# EAGLE design ATXmega64A4U 1 (EAGLE 7.4.0)
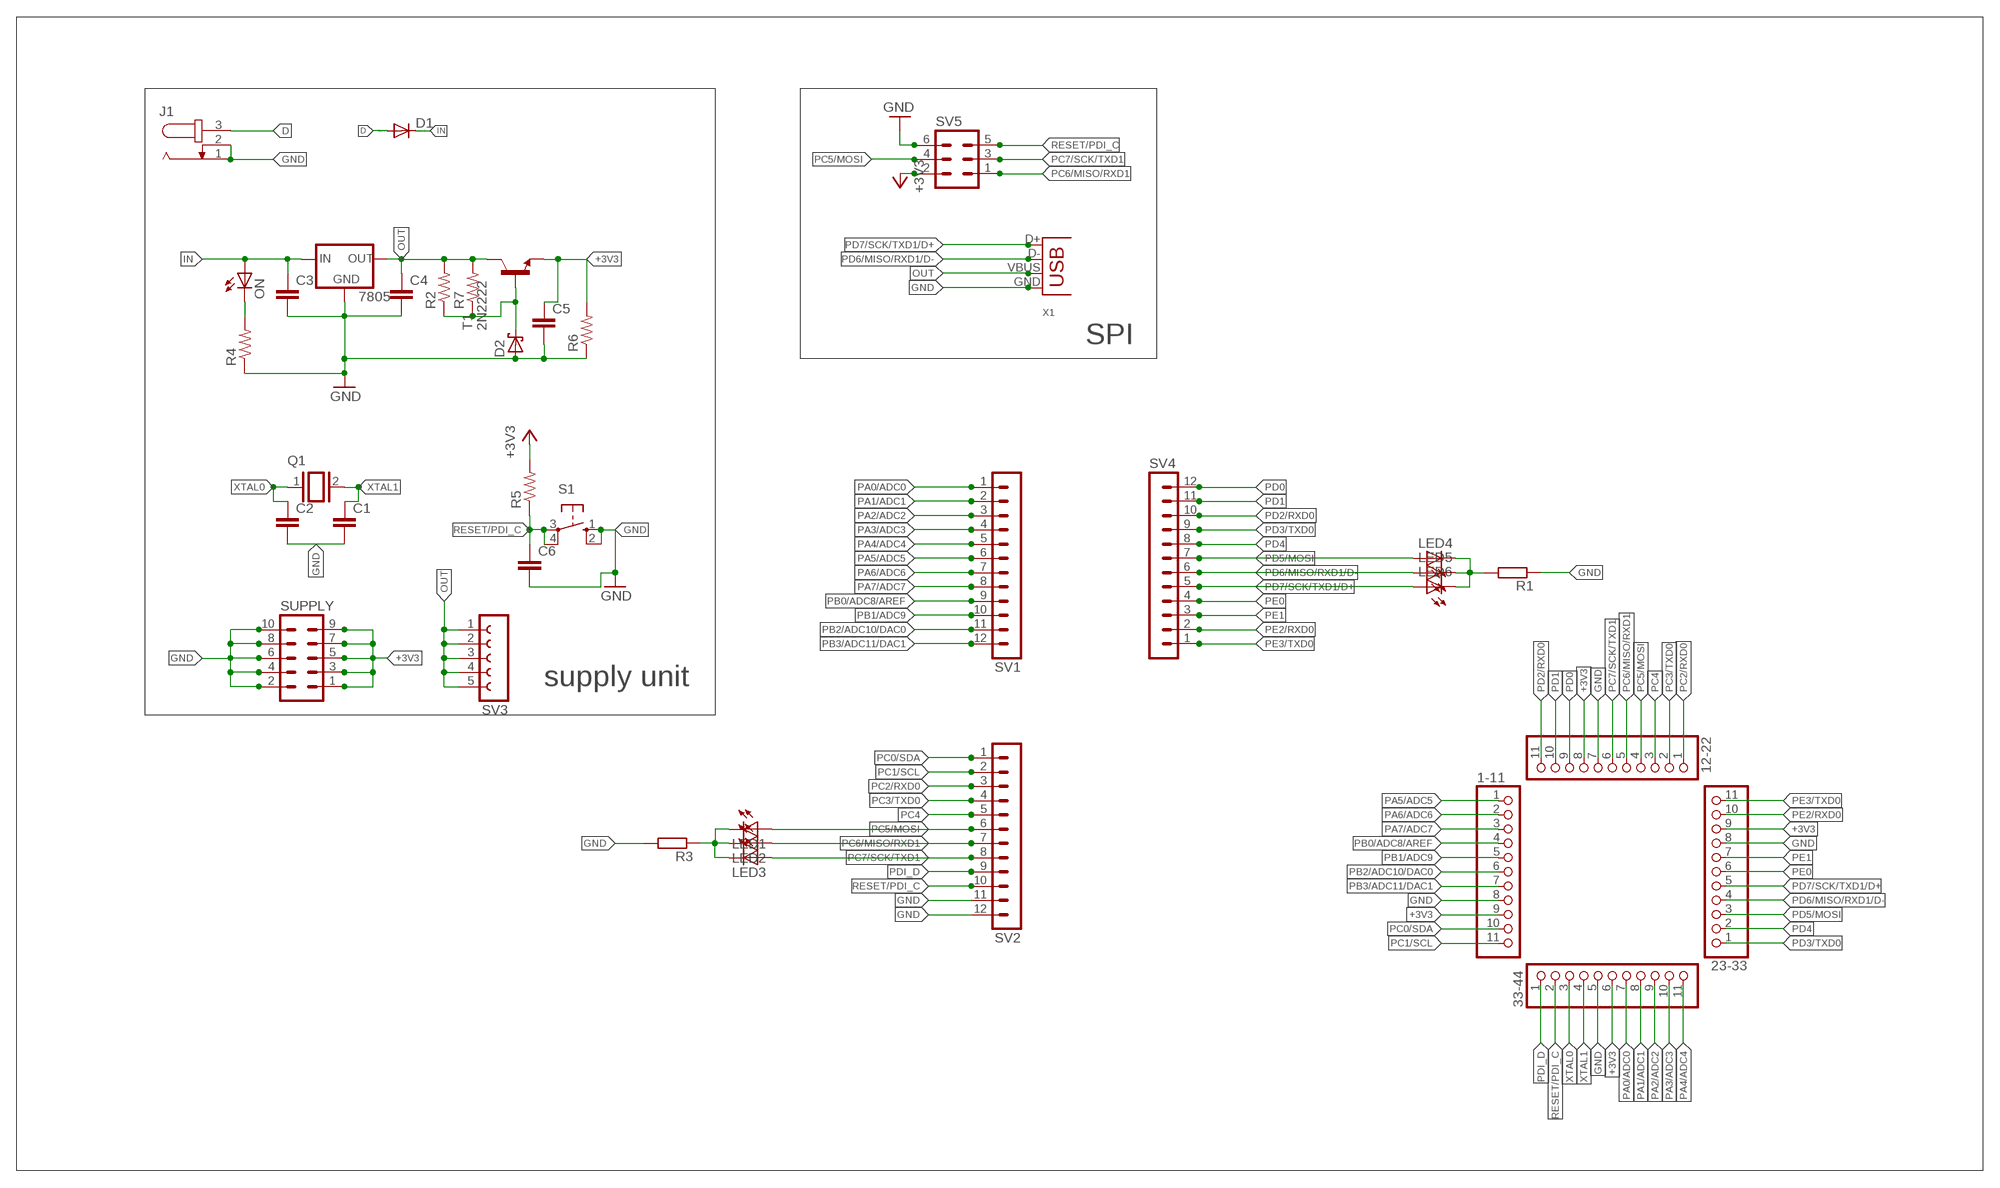
[diagram p0: schematic, sheet 1]

## Parts
1-11  PINHD-1X11/LONG  [1X11]
12-22  PINHD-1X11/LONG  [1X11]
23-33  PINHD-1X11/LONG  [1X11]
33-44  PINHD-1X11/LONG  [1X11]
7805  78XXL  [78XXL]
C1  C-EU025-025X050  [C025-025X050]
C2  C-EU025-025X050  [C025-025X050]
C3  C-EU025-025X050  [C025-025X050]
C4  C-EU025-025X050  [C025-025X050]
C5  C-EU025-025X050  [C025-025X050]
C6  C-EU025-025X050  [C025-025X050]
D1  1N4004  [DO41-10]
D2  SCHOTTKY-DIODEDO35-7  [DO35-7]
J1  JACK-PLUG0  [SPC4077]
LED1  LEDCHIPLED_0805  [CHIPLED_0805]
LED2  LEDCHIPLED_0805  [CHIPLED_0805]
LED3  LEDCHIPLED_0805  [CHIPLED_0805]
LED4  LEDCHIPLED_0805  [CHIPLED_0805]
LED5  LEDCHIPLED_0805  [CHIPLED_0805]
LED6  LEDCHIPLED_0805  [CHIPLED_0805]
ON  LEDCHIP-LED0805  [CHIP-LED0805]
Q1  XTAL/S  [QS]
R1  R-EU_0207/7  [0207/7]
R2  R-US_0207/7  [0207/7]
R3  R-EU_0207/7  [0207/7]
R4  R-US_0207/7  [0207/7]
R5  R-US_0207/7  [0207/7]
R6  R-US_0207/7  [0207/7]
R7  R-US_0207/7  [0207/7]
S1  10-XX  [B3F-10XX]
SUPPLY  MA05-2  [MA05-2]
SV1  MA12-1  [MA12-1]
SV2  MA12-1  [MA12-1]
SV3  FE05-1  [FE05-1]
SV4  MA12-1  [MA12-1]
SV5  MA03-2  [MA03-2]
T1  2N2222  [TO18]
X1  USB-B-H  [USB-B-H]

## Nets
+3V3: 1-11.9 12-22.8 23-33.9 33-44.6 C5.1 R5.2 R6.2 SUPPLY.1 SUPPLY.3 SUPPLY.5 SUPPLY.7 SUPPLY.9 SV5.2 T1.1(E)
D: D1.A J1.3
GND: 1-11.8 12-22.7 23-33.8 33-44.5 7805.GND C1.2 C2.2 C3.2 C4.2 C5.2 C6.2 D2.A J1.1 J1.2 R1.1 R3.2 R4.1 R6.1 S1.1(S) S1.2(S1) SUPPLY.2 SUPPLY.4 SUPPLY.6 SUPPLY.8 SUPPLY.10 SV2.11 SV2.12 SV5.6 X1.GND
IN: 7805.IN C3.1 D1.C ON.A
N$1: ON.C R4.2
N$2: LED1.C LED2.C LED3.C R3.1
N$4: D2.C R2.1 R7.1 T1.2(B)
N$5: LED4.C LED5.C LED6.C R1.2
OUT: 7805.OUT C4.1 R2.2 R7.2 SV3.1 SV3.2 SV3.3 SV3.4 SV3.5 T1.3(C) X1.VBUS
PA0/ADC0: 33-44.7 SV1.1
PA1/ADC1: 33-44.8 SV1.2
PA2/ADC2: 33-44.9 SV1.3
PA3/ADC3: 33-44.10 SV1.4
PA4/ADC4: 33-44.11 SV1.5
PA5/ADC5: 1-11.1 SV1.6
PA6/ADC6: 1-11.2 SV1.7
PA7/ADC7: 1-11.3 SV1.8
PB0/ADC8/AREF: 1-11.4 SV1.9
PB1/ADC9: 1-11.5 SV1.10
PB2/ADC10/DAC0: 1-11.6 SV1.11
PB3/ADC11/DAC1: 1-11.7 SV1.12
PC0/SDA: 1-11.10 SV2.1
PC1/SCL: 1-11.11 SV2.2
PC2/RXD0: 12-22.1 SV2.3
PC3/TXD0: 12-22.2 SV2.4
PC4: 12-22.3 SV2.5
PC5/MOSI: 12-22.4 LED1.A SV2.6 SV5.4
PC6/MISO/RXD1: 12-22.5 LED2.A SV2.7 SV5.1
PC7/SCK/TXD1: 12-22.6 LED3.A SV2.8 SV5.3
PD0: 12-22.9 SV4.12
PD1: 12-22.10 SV4.11
PD2/RXD0: 12-22.11 SV4.10
PD3/TXD0: 23-33.1 SV4.9
PD4: 23-33.2 SV4.8
PD5/MOSI: 23-33.3 LED4.A SV4.7
PD6/MISO/RXD1/D-: 23-33.4 LED5.A SV4.6 X1.D-
PD7/SCK/TXD1/D+: 23-33.5 LED6.A SV4.5 X1.D+
PDI_D: 33-44.1 SV2.9
PE0: 23-33.6 SV4.4
PE1: 23-33.7 SV4.3
PE2/RXD0: 23-33.10 SV4.2
PE3/TXD0: 23-33.11 SV4.1
RESET/PDI_C: 33-44.2 C6.1 R5.1 S1.3(P) S1.4(P1) SV2.10 SV5.5
XTAL0: 33-44.3 C2.1 Q1.1
XTAL1: 33-44.4 C1.1 Q1.2

## Notes on the sheet
- SPI
- supply unit

## Library data of the parts
1-11 12-22 23-33 33-44 = pinhead_v2:PINHD-1X11: PIN HEADER
7805 = v-reg:78XXL: VOLTAGE REGULATOR
C1-C6 = resistor:C-EU: CAPACITOR, European symbol
D1 = diode:1N4004: DIODE general purpose rectifier, 1 A
D2 = diode:SCHOTTKY-DIODE: Schottky Diode
J1 = con-jack:JACK-PLUG: DC POWER JACK Power Jack, DC, Right Angle, Through Hole, Rated 5A at 16VDC, PC Terminals Distributor: Farnell (www.Farnell.de) Drawing: 84N1161.pdf / 84N1162.pdf Manufacturer: SPC Technology (www.spctechnology.com) Type: SPC4077 / SPC 4078; OC_FARNELL: unknown; OC_NEWARK: unknown
LED1-LED6 ON = led:LED: LED OSRAM: - CHIPLED LG R971, LG N971, LY N971, LG Q971, LY Q971, LO R971, LY R971 LH N974, LH R974 LS Q976, LO Q976, LY Q976 LO Q996 - Hyper CHIPLED LW Q18S LB Q993, LB Q99A, LB R99A - SideLED LS A670, LO A670, LY A670, LG A670, LP A670 LB A673, LV A673, LT A673, LW A673 LH A674 LY A675 LS A676, LA A676, LO A676, LY A676, LW A676 LS A679, LY A679, LG A679 - Hyper Micro SIDELED® LS Y876, LA Y876, LO Y876, LY Y876 LT Y87S - SmartLED LW L88C, LW L88S LB L89C, LB L89S, LG L890 LS L89K, LO L89K, LY L89K LS L896, LA L896, LO L896, LY L896 - TOPLED LS T670, LO T670, LY T670, LG T670, LP T670 LSG T670, LSP T670, LSY T670, LOP T670, LYG T670 LG T671, LOG T671, LSG T671 LB T673, LV T673, LT T673, LW T673 LH T674 LS T676, LA T676, LO T676, LY T676, LB T676, LH T676, LSB T676, LW T676 LB T67C, LV T67C, LT T67C, LS T67K, LO T67K, LY T67K, LW E67C LS E67B, LA E67B, LO E67B, LY E67B, LB E67C, LV E67C, LT E67C LW T67C LS T679, LY T679, LG T679 LS T770, LO T770, LY T770, LG T770, LP T770 LB T773, LV T773, LT T773, LW T773 LH T774 LS E675, LA E675, LY E675, LS T675 LS T776, LA T776, LO T776, LY T776, LB T776 LHGB T686 LT T68C, LB T68C - Hyper Mini TOPLED® LB M676 - Mini TOPLED Santana® LG M470 LS M47K, LO M47K, LY M47K Source: http://www.osram.convergy.de LUXEON: - LUMILED® LXK2-PW12-R00, LXK2-PW12-S00, LXK2-PW14-U00, LXK2-PW14-V00 LXK2-PM12-R00, LXK2-PM12-S00, LXK2-PM14-U00 LXK2-PE12-Q00, LXK2-PE12-R00, LXK2-PE12-S00, LXK2-PE14-T00, LXK2-PE14-U00 LXK2-PB12-K00, LXK2-PB12-L00, LXK2-PB12-M00, LXK2-PB14-N00, LXK2-PB14-P00, LXK2-PB14-Q00 LXK2-PR12-L00, LXK2-PR12-M00, LXK2-PR14-Q00, LXK2-PR14-R00 LXK2-PD12-Q00, LXK2-PD12-R00, LXK2-PD12-S00 LXK2-PH12-R00, LXK2-PH12-S00 LXK2-PL12-P00, LXK2-PL12-Q00, LXK2-PL12-R00 Source: www.luxeon.com KINGBRIGHT: KA-3528ASYC Source: www.kingbright.com
Q1 = special:XTAL/S: CRYSTAL
R1 R3 = resistor:R-EU_: RESISTOR, European symbol
R2 R4-R7 = rcl:R-US_: RESISTOR, American symbol
S1 = switch-omron:10-XX: OMRON SWITCH; MPN: B3F-1000; OC_FARNELL: 176432; OC_NEWARK: 36M3542
SUPPLY = con-lstb:MA05-2: PIN HEADER; OC_FARNELL: unknown; OC_NEWARK: unknown
SV1 SV2 SV4 = con-lstb:MA12-1: PIN HEADER; OC_FARNELL: unknown; OC_NEWARK: unknown
SV3 = con-lsta:FE05-1: FEMALE HEADER; OC_FARNELL: unknown; OC_NEWARK: unknown
SV5 = con-lstb:MA03-2: PIN HEADER; OC_FARNELL: unknown; OC_NEWARK: unknown
T1 = transistor-neu-to92:2N2222: NPN TRANSISTOR
X1 = con-usb-3:USB: USB Connectors

## Board
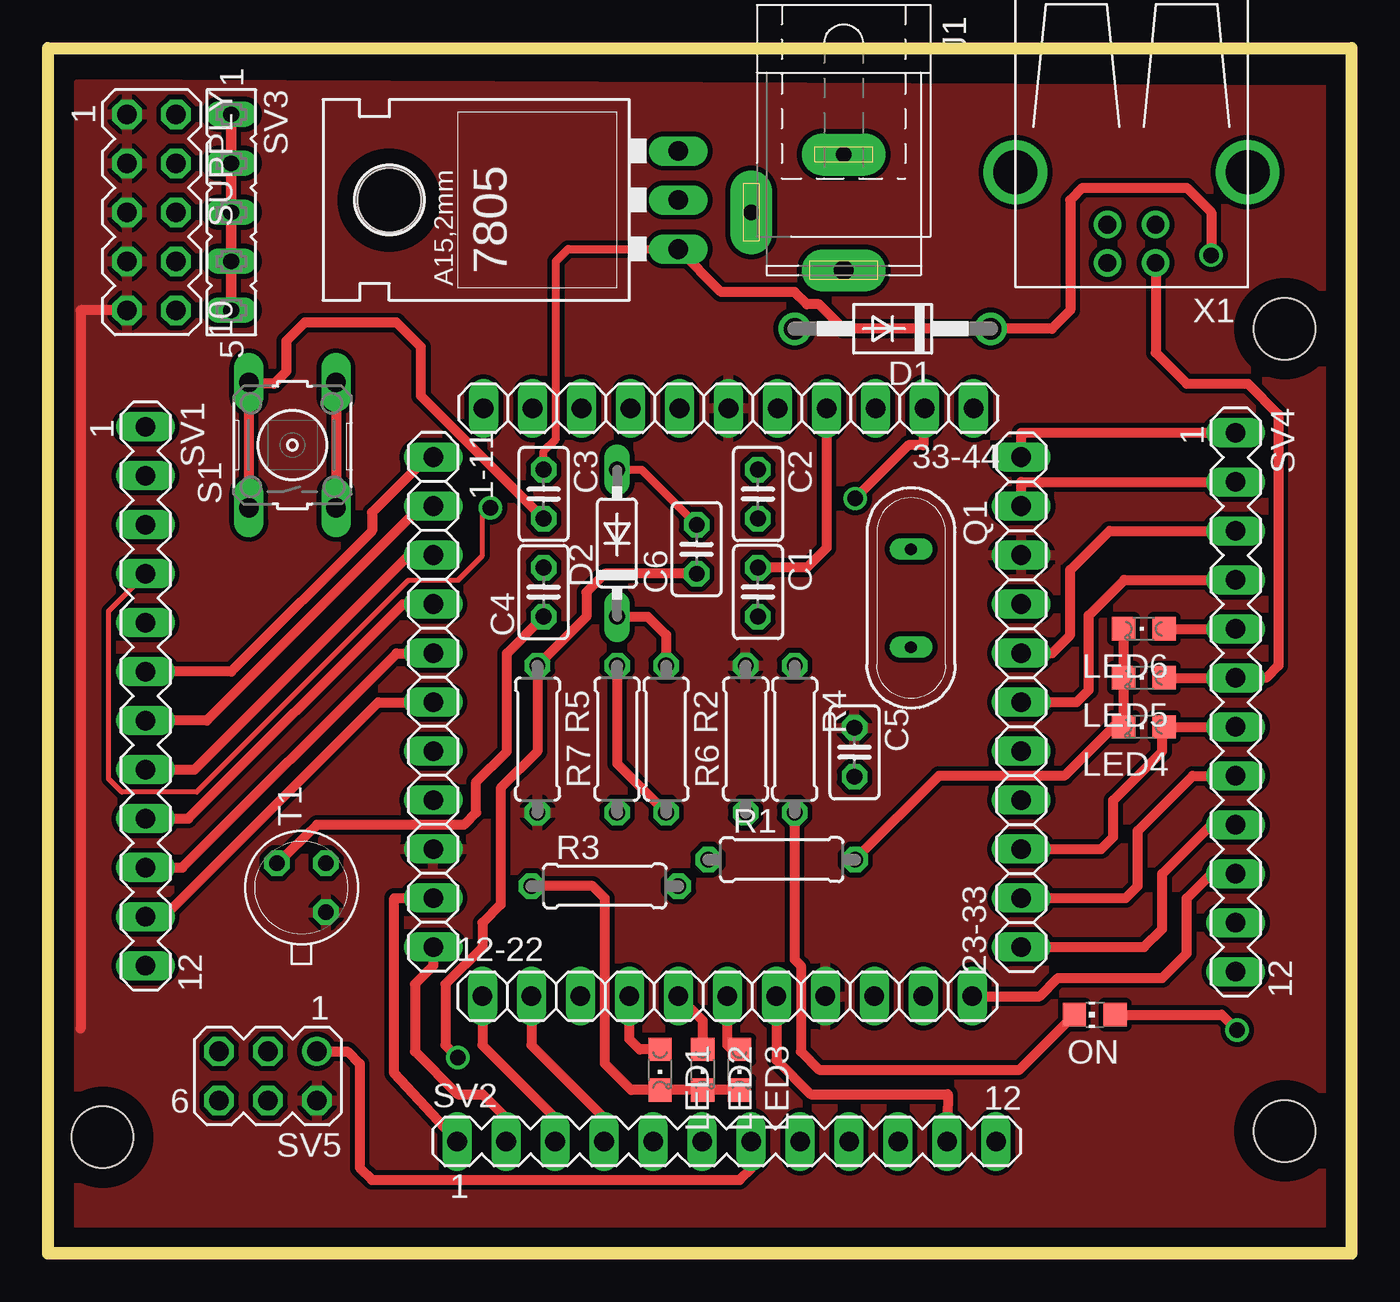
[diagram p1: board, top side]
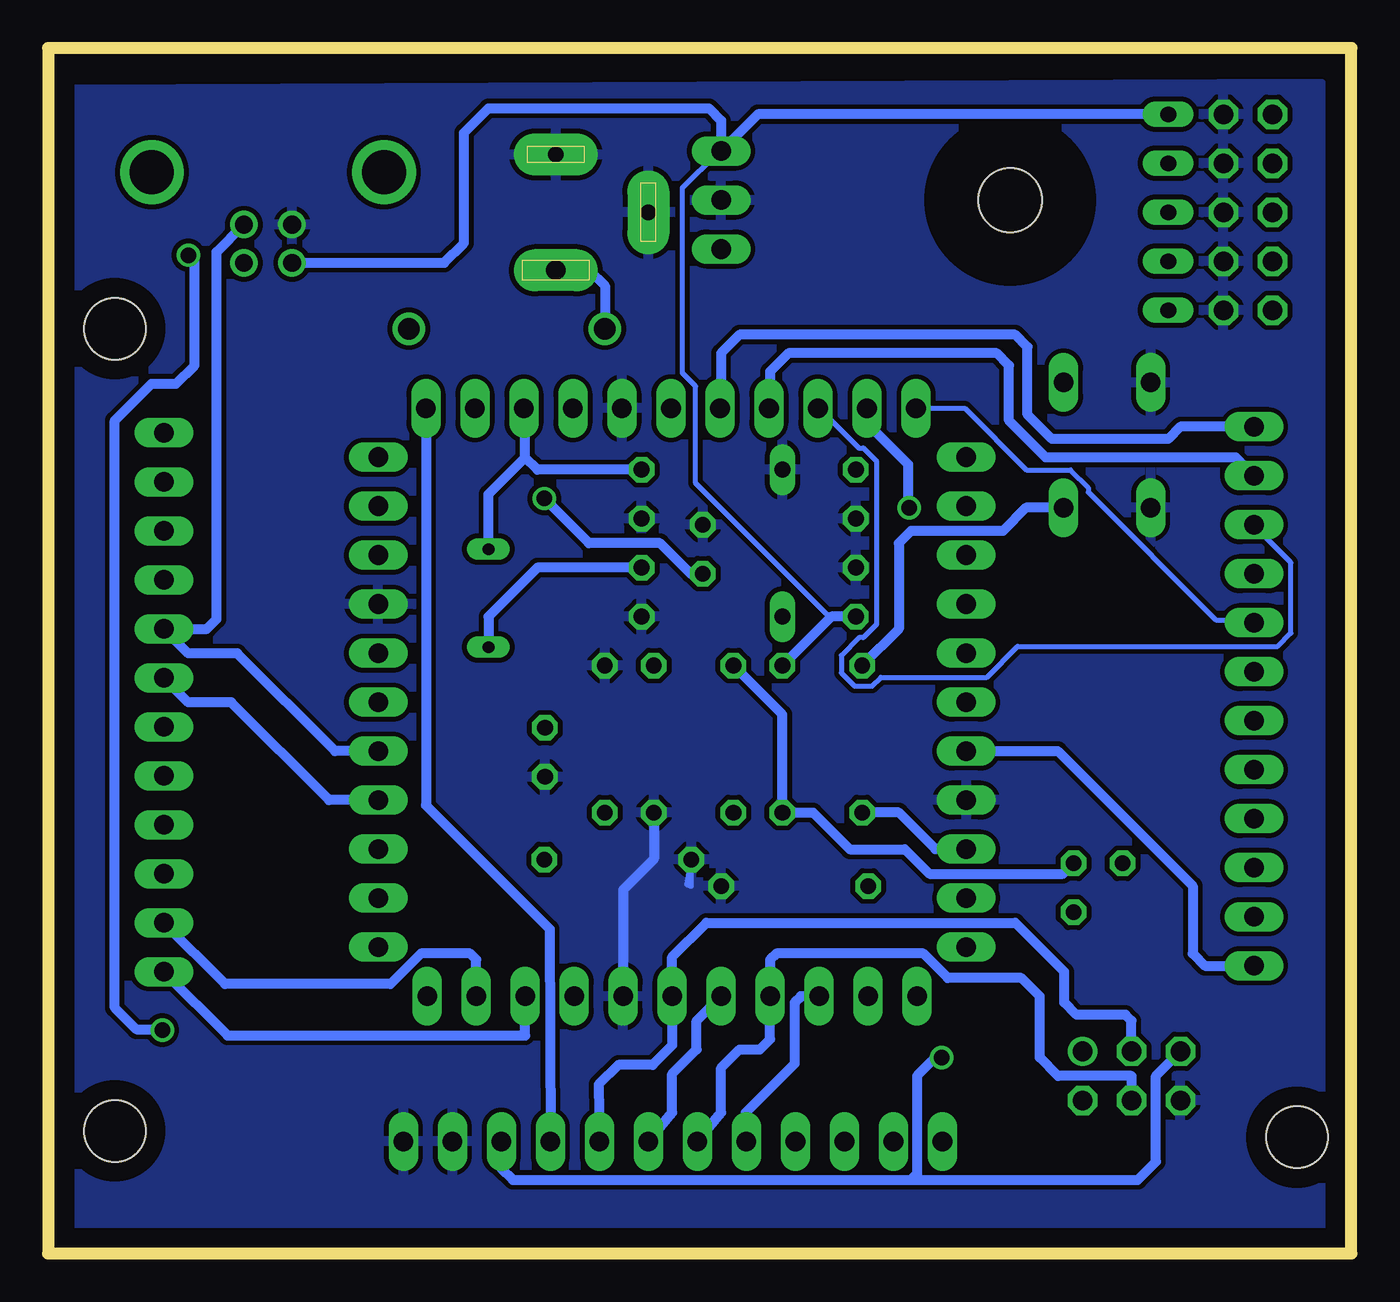
[diagram p2: board, bottom side, seen from below]

Size 67.55 x 62.48 mm. Coordinates in mm from the lower left corner, seen from the top.
Outline: 0,62.48 67.55,62.48 67.55,0 0,0 0,62.48
Copper layers (1*16): Top 0.035mm / dielectric 1.5mm / Bottom 0.035mm
Design rules "default": minimum track width 10mil, minimum drill 24mil, track to track 8mil, track to pad 8mil, pad to pad 8mil, via to via 8mil, smd to smd 8mil, copper to edge 40mil, drill to drill 8mil, minimum pad ring 10mil, minimum via ring 8mil, stop-mask expansion 4mil, vias tented up to drill 0mil, thermal gap 10mil
Holes 3.2 mm at 64.1,6.35 64.1,47.94 2.82,6.03

### Footprints (pad centres in the part's own frame; a part is rotated, then mirrored left to right if it is on the bottom)
1X11 = drill 1.016 long: 1 -12.7,0; 2 -10.16,0; 3 -7.62,0; 4 -5.08,0; 5 -2.54,0; 6 0,0; 7 2.54,0; 8 5.08,0; 9 7.62,0; 10 10.16,0; 11 12.7,0
78XXL = drill 1.016 long: GND 0,-3.81; IN -2.54,-3.81; OUT 2.54,-3.81 | hole 3.302: 0,11.176
C025-025X050 = drill 0.813 octagon: 1 -1.27,0; 2 1.27,0
DO41-10 = drill 1.118: A 5.08,0; C -5.08,0
DO35-7 = drill 0.813 long: A 3.81,0; C -3.81,0
SPC4077 = drill 0.8 pad 2.184 long: 1 -3,0; 2 0,-4.8 | drill 1 pad 2.184 long: 3 3,0
CHIPLED_0805 = smd 1.2 x 1.2: A 0,-1.05; C 0,1.05
CHIP-LED0805 = smd 1.2 x 1.2: A 0,-1.05; C 0,1.05
QS = drill 0.61 long: 1 -2.54,0; 2 2.54,0
0207/7 = drill 0.813 octagon: 1 -3.81,0; 2 3.81,0
B3F-10XX = drill 1.016 long: 1 -3.251,2.261; 2 3.251,2.261; 3 -3.251,-2.261; 4 3.251,-2.261
MA05-2 = drill 1.016 octagon: 1 -5.08,-1.27; 2 -5.08,1.27; 3 -2.54,-1.27; 4 -2.54,1.27; 5 0,-1.27; 6 0,1.27; 7 2.54,-1.27; 8 2.54,1.27; 9 5.08,-1.27; 10 5.08,1.27
MA12-1 = drill 1.016 long: 1 -13.97,0; 2 -11.43,0; 3 -8.89,0; 4 -6.35,0; 5 -3.81,0; 6 -1.27,0; 7 1.27,0; 8 3.81,0; 9 6.35,0; 10 8.89,0; 11 11.43,0; 12 13.97,0
FE05-1 = drill 0.813 long: 1 -5.08,0; 2 -2.54,0; 3 0,0; 4 2.54,0; 5 5.08,0
MA03-2 = drill 1.016: 1 -2.54,-1.27 | drill 1.016 octagon: 2 -2.54,1.27; 3 0,-1.27; 4 0,1.27; 5 2.54,-1.27; 6 2.54,1.27
TO18 = drill 0.813 octagon: 1 -1.27,-1.27; 2 1.27,-1.27; 3 1.27,1.27
USB-B-H = drill 0.914: D+ 0,1.25; D- 1.981,1.25; GND 0,-1.25; VBUS 1.981,-1.25 | drill 2.286: P$1 -2.718,-6.02; P$2 -2.718,6.02

### Placement (x,y rotation side)
1-11  19.96,28.59 270 top
12-22  35.2,13.34 0 top
23-33  50.44,28.59 90 top
33-44  35.27,43.81 180 top
7805  28.85,54.61 90 top
C1  36.79,34.29 270 top
C2  36.79,39.37 270 top
C3  25.68,39.37 270 top
C4  25.68,34.29 90 top
C5  41.8,25.98 270 top
C6  33.62,36.51 90 top
D1  43.78,47.94 180 top
D2  29.49,36.83 90 top
J1  41.24,53.98 270 top
LED1  31.71,9.52 180 top
LED2  33.93,9.52 180 top
LED3  35.84,9.52 180 top
LED4  56.79,27.3 90 top
LED5  56.79,29.84 90 top
LED6  56.79,32.38 90 top
ON  54.25,12.38 90 top
Q1  44.73,33.97 270 top
R1  38.02,20.42 0 top
R2  32.03,26.67 270 top
R3  28.85,19.05 0 top
R4  38.7,26.67 270 top
R5  25.36,26.67 270 top
R6  36.16,26.67 90 top
R7  29.49,26.67 90 top
S1  12.66,41.91 90 top
SUPPLY  5.36,53.98 270 top
SV1  5.04,28.89 270 top
SV2  35.17,5.8 0 top
SV3  9.49,53.98 270 top
SV4  61.56,28.57 270 top
SV5  11.39,9.21 180 top
T1  13.13,18.96 90 top
X1  56.16,53.34 270 top

### Tracks (layer width: path | path; a pad name or v marks a point on that pad's centre or on a via)
+3V3
  Top 0.508: SUPPLY.9 1.68,48.89 1.68,11.66
  Bottom 0.508: 1-11.9 21.56,20.97 23.46,22.86 R5.2
  pour Top (isolate 0.254): 1.55,60.64 66.32,60.32 66.28,1.17 1.51,1.49
D
  Bottom 0.508: J1.3 39.51,50.98 38.7,50.16 D1.A
GND
  Top 0.406: D2.A 30.76,40.64 C6.2
  Top 0.508: 12-22.7 37.74,10.03 39.52,8.25 46.63,8.25 SV2.11 | S1.1 S1.2 10.48,45.09 11.71,45.09 12.34,45.72 12.34,47.31 13.3,48.26 18.06,48.26 19.33,46.99 19.33,44.45 C3.2
  Bottom 0.254: 34.21,19.05 R1.1 34.44,19.13 34.25,19.05
  Bottom 0.508: R6.1 36.16,20.45 37.74,18.86 12-22.7
  pour Bottom (isolate 0.254): 1.55,60.64 66.32,60.32 66.28,1.17 1.51,1.49
IN  (via drill 0.8)
  Top 0.406: C3.1 25.68,41.59 26.31,42.23 26.31,51.43 26.95,52.07 7805.IN
  Top 0.508: v60.29,51.75 60.29,53.98 59.02,55.24 53.62,55.24 52.98,54.61 52.98,48.89 52.03,47.94 D1.C 41.24,47.94 39.97,49.21 39.33,49.21 38.7,49.85 34.89,49.85 7805.IN | ON.A 60.83,12.38 v61.63,11.58
  Bottom 0.508: v60.29,51.75 59.97,51.43 59.97,46.04 60.92,45.09 62.19,45.09 64.1,43.18 64.1,12.74 62.98,11.62 61.67,11.62 v61.63,11.58
N$1
  Top 0.508: R4.2 38.7,15.24 39.01,14.92 39.01,10.48 39.97,9.52 50.35,9.52 ON.C
N$2
  Top 0.508: LED3.C LED2.C LED1.C 30.22,8.47 28.85,9.84 28.85,18.41 28.22,19.05 R3.1
N$4
  Top 0.508: D2.C 31.08,33.02 32.03,32.07 R2.1
  Bottom 0.508: R2.1 29.49,27.94 R7.1 27.9,22.86 26,20.95 23.14,20.95 21.87,19.69 14.95,19.69 T1.2
N$5
  Top 0.508: LED6.C LED5.C LED4.C 55.21,27.3 52.67,24.77 46.18,24.77 R1.2
OUT
  Top 0.508: R7.2 29.49,25.4 R2.2 | T1.3 13.93,22.23 21.55,22.23 22.19,22.86 22.19,24.45 23.77,26.03 23.77,31.12 C4.1 | SV3.1 SV3.2 SV3.3 SV3.4 SV3.5 SV3.1
  Bottom 0.254: 7805.OUT 32.84,57.07 34.67,55.24 34.67,45.64 33.99,44.96 33.99,39.93 27.13,33.07 26.95,33.02
  Bottom 0.508: C4.1 26.95,33.02 R7.2 | X1.VBUS 47.03,51.36 46,52.39 46,58.1 44.73,59.37 33.3,59.37 32.66,58.74 7805.OUT 30.76,59.05 SV3.1
PA0/ADC0
  Bottom 0.508: SV1.1 8.85,42.86 9.49,42.23 15.52,42.23 16.79,43.5 16.79,46.99 17.42,47.62 31.71,47.62 32.66,46.67 32.66,43.88 33-44.7
PA1/ADC1
  Bottom 0.508: 33-44.8 30.12,43.88 30.12,45.72 29.17,46.67 18.38,46.67 17.74,46.04 17.74,43.18 15.84,41.27 5.99,41.27 SV1.2
PA2/ADC2
  Bottom 0.254: SV1.3 4.95,37.64 3.12,35.81 3.12,32.16 3.81,31.47 17.3,31.47 18.9,29.87 24.38,29.87 24.84,29.41 25.76,29.41 26.44,30.1 26.44,31.01 25.53,31.93 25.3,31.93 24.61,32.61 24.61,41.07 25.3,41.76 25.53,41.76 27.58,43.81 33-44.9
PA3/ADC3  (via drill 0.8)
  Top 0.254: SV1.4 4.95,35.13 3.12,33.3 3.12,24.61 3.81,23.93 7.7,23.93 18.67,34.9 21.21,34.9 22.5,36.2 22.5,38.24 v22.92,38.66
  Bottom 0.508: 33-44.10 25.11,43.05 22.97,40.92 22.97,38.71 v22.92,38.66
PA4/ADC4
  Bottom 0.254: 33-44.11 20.04,43.81 16.84,40.62 14.55,40.62 13.64,39.7 13.64,39.47 7.01,32.84 5.18,32.84 SV1.5
PA5/ADC5
  Top 0.508: 1-11.1 19.65,41.27 16.79,38.42 16.79,37.46 9.49,30.16 SV1.6
PA6/ADC6
  Top 0.508: 1-11.2 19.34,38.75 8.22,27.62 SV1.7
PA7/ADC7
  Top 0.508: SV1.8 7.58,25.08 18.69,36.2 19.95,36.2 1-11.3
PB0/ADC8/AREF
  Top 0.508: SV1.9 7.26,22.54 18.38,33.66 19.95,33.66 1-11.4
PB1/ADC9
  Top 0.508: SV1.10 6.95,20 18.06,31.12 19.95,31.12 1-11.5
PB2/ADC10/DAC0
  Top 0.508: SV1.11 5.99,17.46 17.11,28.57 19.95,28.57 1-11.6
PB3/ADC11/DAC1
  Bottom 0.508: 1-11.7 15.21,26.05 8.22,19.05 8.22,15.56 7.58,14.92 SV1.12
PC0/SDA
  Top 0.508: SV2.1 17.93,9.33 17.93,18.43 1-11.10
PC1/SCL
  Top 0.508: SV2.2 23.77,6.98 22.5,8.25 21.23,8.25 19.01,10.48 19.01,13.97 19.96,14.92 1-11.11
PC2/RXD0
  Top 0.508: 12-22.1 22.5,10.79 26.31,6.98 SV2.3
PC3/TXD0
  Top 0.508: 12-22.2 25.04,10.79 28.85,6.98 SV2.4
PC4
  Bottom 0.508: 12-22.3 28.54,13.34 28.85,13.02 28.85,9.84 31.39,7.3 SV2.5
PC5/MOSI
  Top 0.508: LED1.A 30.66,10.57 30.12,11.11 12-22.4
  Bottom 0.508: SV5.4 11.39,9.21 15.2,9.21 16.15,10.16 16.15,13.34 17.11,14.29 20.92,14.29 22.19,15.56 29.81,15.56 30.12,15.24 12-22.4 30.12,11.11 30.66,10.57 LED1.A 32.66,9.62 32.66,7.3 SV2.6
PC6/MISO/RXD1
  Top 0.508: LED2.A 33.93,12.06 12-22.5 | SV5.1 15.52,10.48 16.15,9.84 16.15,4.45 16.79,3.81 35.84,3.81 36.47,4.45 SV2.7
  Bottom 0.508: SV2.7 35.2,7.3 35.2,9.3 LED2.A 33.93,12.06 12-22.5
PC7/SCK/TXD1
  Top 0.508: LED3.A 35.42,10.57 35.2,10.79 12-22.6
  Bottom 0.508: SV2.8 39.01,8.76 38,9.78 36.22,9.78 35.2,10.79 12-22.6 35.2,15.37 33.43,17.14 17.42,17.14 14.88,14.61 14.88,13.02 14.25,12.38 11.71,12.38 11.39,12.06 SV5.3
PD0
  Bottom 0.508: SV4.12 58.25,11.3 42.82,11.3 12-22.9
PD1
  Bottom 0.508: 12-22.10 45.36,15.24 45.68,15.56 48.22,15.56 49.81,13.97 58.38,13.97 SV4.11
PD2/RXD0
  Top 0.508: SV4.10 60.29,19.69 59.02,18.41 59.02,15.56 57.75,14.29 52.35,14.29 51.4,13.34 12-22.11
PD3/TXD0
  Top 0.508: 23-33.1 56.81,15.89 57.75,16.83 57.75,19.69 60.29,22.23 SV4.9
PD4
  Top 0.508: 23-33.2 55.85,18.43 56.48,19.05 56.48,21.91 59.33,24.77 SV4.8
PD5/MOSI
  Top 0.508: SV4.7 LED4.A 57.75,27.21 57.75,26.03 55.21,23.49 55.21,21.59 54.58,20.97 23-33.3
PD6/MISO/RXD1/D-
  Top 0.508: LED5.A SV4.6 63.14,29.84 63.78,30.48 63.78,43.5 62.19,45.09 59.02,45.09 57.41,46.69 X1.D-
  Bottom 0.508: 23-33.4 53,23.51 58.06,28.57 60.29,28.57 SV4.6
PD7/SCK/TXD1/D+
  Top 0.508: LED6.A SV4.5
  Bottom 0.508: X1.D+ 58.83,51.92 58.83,32.89 59.33,32.38 SV4.5 60.29,31.12 57.75,31.12 52.68,26.05 23-33.5 | X1.D+
PDI_D
  Bottom 0.508: 33-44.1 47.97,23.24 41.55,16.83 SV2.9
PE0
  Top 0.508: SV4.4 55.78,34.92 53.94,33.08 53.94,29.21 53.31,28.59 23-33.6
PE1
  Top 0.508: SV4.3 55.02,37.46 52.98,35.43 52.98,32.07 52.04,31.13 23-33.7
PE2/RXD0
  Top 0.508: 23-33.10 50.44,40.01 SV4.2
PE3/TXD0
  Top 0.508: 23-33.11 50.44,42.55 SV4.1
RESET/PDI_C  (via drill 0.8)
  Top 0.508: 33-44.2 45.36,43.75 45.36,41.91 44.6,41.91 v41.83,39.14 | C6.1 28.85,35.24 27.9,34.29 27.9,33.02 R5.1 25.36,26.03 23.46,24.13 23.46,18.1 22.5,17.14 22.5,15.88 20.6,13.97 20.6,10.79 v21.23,10.16 | S1.4 S1.3
  Bottom 0.508: C6.1 34.25,35.24 35.84,36.83 39.52,36.83 v41.83,39.14 | S1.3 16.87,38.66 18.06,37.46 22.82,37.46 23.46,36.83 23.46,32.38 R5.1 | SV2.10 44.09,4.45 43.46,3.81 22.82,3.81 | 22.82,3.81 11.07,3.81 10.12,4.76 10.12,9.21 SV5.5 | v21.23,10.16 21.55,10.16 22.5,9.21 22.5,4.13 22.82,3.81
XTAL0
  Bottom 0.508: C2.1 42.19,40.64 42.82,41.27 | 42.82,41.27 42.82,43.75 33-44.3 | Q1.1 44.73,39.37 42.82,41.27
XTAL1
  Top 0.508: 33-44.4 40.35,36.58 39.33,35.56 C1.1
  Bottom 0.508: C1.1 42.19,35.56 44.73,33.02 Q1.2

### Text on the board
tValues: 7805 | +3V3 | +5V | GND | D | PA0 | TXD0 | PE3 | PA1 | 1nf | RXD0 | PE2 | 1nf | 1nf | PA2 | PE1 | PA3 | PE0 | 1nf | Z | 1nf | 32M | PA4 | PD7 | PA5 | PD6 | PA6 | PD5 | 10k | 47E | 1k2 | 47E | PA7 | 330E | 100nf | PD4 | Analog inputs | PB0 | TXD0 | PD3 | 330E | PB1 | 330E | RXD0 | PD2 | PB2 | PD1 | PB3 | ON | PD0 | ICSP | SDA | SCL | RXD0 | TXD0 | RXD1 | TXD1 | PDI_D | PDI_C | - | PC0 | PC1 | PC2 | PC3 | PC4 | PC5 | PC6 | PC7 | PDI | RST | GND